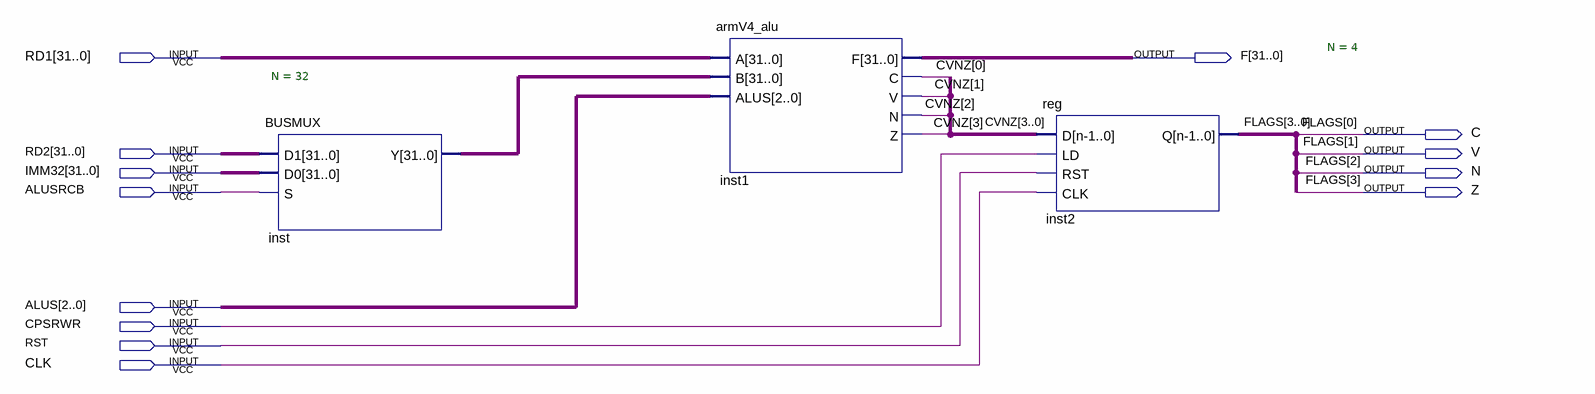
[diagram p0: schematic sheet]
// Quartus schematic execute.bdf as structural Verilog: 3 symbols, 13 pins
module execute (
  input  [31:0] RD1,
  input  [31:0] RD2,
  input  [31:0] IMM32,
  input  ALUSRCB,
  input  [2:0] ALUS,
  input  CPSRWR,
  input  RST,
  input  CLK,
  output [31:0] F,
  output C,
  output V,
  output N,
  output Z
);

  wire [3:0] CVNZ;
  wire [31:0] inst_y;

  BUSMUX #(.N(32)) inst (.D1(RD2), .D0(IMM32), .S(ALUSRCB), .Y(inst_y));
  armV4_alu inst1 (.A(RD1), .B(inst_y), .ALUS(ALUS), .C(CVNZ[0]), .V(CVNZ[1]), .N(CVNZ[2]), .Z(CVNZ[3]), .F(F));
  \reg  #(.N(4)) inst2 (.D(CVNZ), .LD(CPSRWR), .RST(RST), .CLK(CLK), .Q({Z, N, V, C}));

  // Other names for the same wires on the sheet: FLAGS[3:0] = {Z, N, V, C}
endmodule
